# EasyEDA schematic remote-digital-liquid-sensor.json
TITLE: Sheet_1; REV: 1.0; Date: 2024-01-29; Sheet: 1/1; Drawn By: Gabriel Thien; Company: Your Company
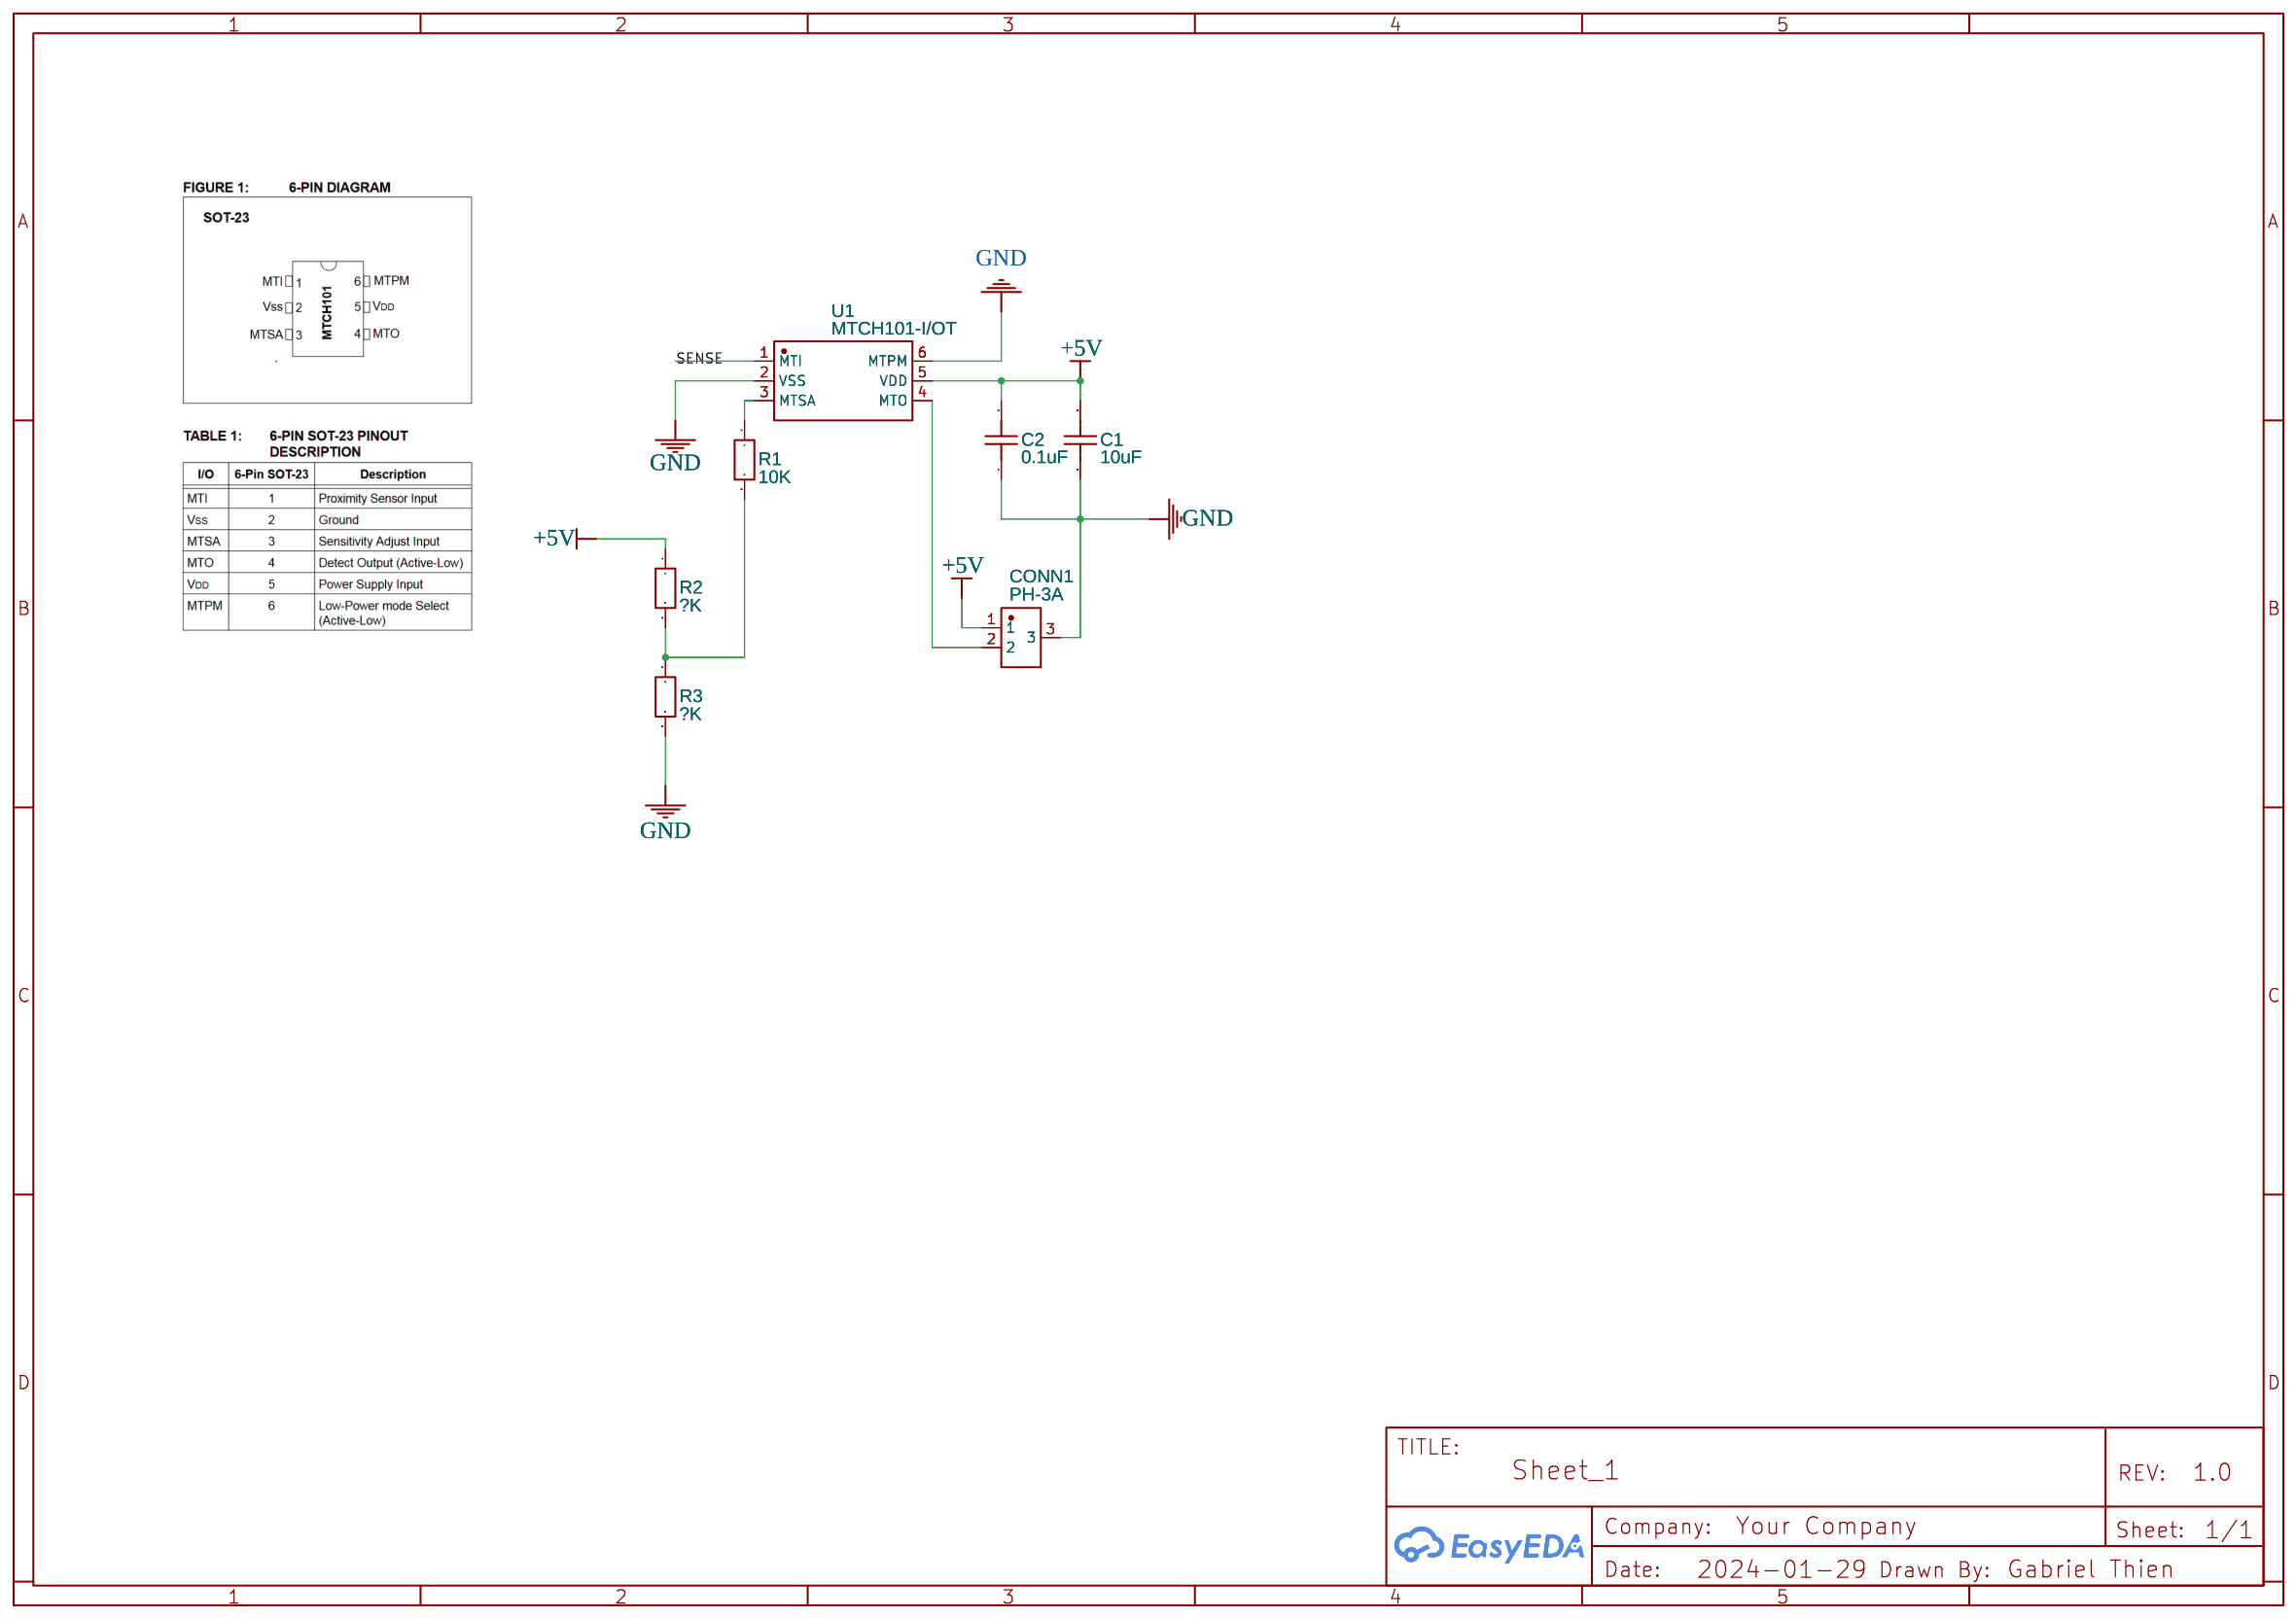
[diagram p0: schematic sheet]

## Parts
C1  10uF  [C0603]
C2  0.1uF  [C0603]
CONN1  PH-3A  [CONN-TH_PH-3A_RED]
R1  10K  [R0603]
R2  ?K  [R0603]
R3  ?K  [R0603]
U1  MTCH101-I/OT  [SOT-23-6_L2.9-W1.6-P0.95-LS2.8-BR]

## Library data of the parts
C1 C2 = C_0603_US: Contributor: LCEDA_Lib
CONN1 = PH-3A/红色: Contributor: lcsc; Supplier: LCSC; Supplier Part: C9900015915; Manufacturer: null; JLCPCB Part Class: Extended Part
R1-R3 = R_0603_EU: Contributor: LCEDA_Lib
U1 = MTCH101-I/OT: Contributor: lcsc; Supplier: LCSC; Supplier Part: C626258; Manufacturer: MICROCHIP(美国微芯); JLCPCB Part Class: Extended Part

## Nets
+5V: C1.2 C2.2 CONN1.1 R2.1 U1.5(VDD)
GND: C1.1 C2.1 CONN1.3 R3.2 U1.2(VSS) U1.6(MTPM)
SENSE: U1.1(MTI)
Net-(CONN1-2): CONN1.2 U1.4(MTO)
Net-(R1-1): R1.1 U1.3(MTSA)
Net-(R1-2): R1.2 R2.2 R3.1
